# Altium schematic sheet OK6010_DB_DAC_s.SchDoc
size 260 x 195 mm; PageSetup: Record=PageOptions|CenterHorizontal=True|CenterVertical=True|PrintScale=0.82|XCorrection=1.00|YCorrection=1.00|PrintKind=2|BorderSize=5000000|LeftOffset=0|BottomOffset=0|Orientation=2|PaperLength=1000|PaperWidth=1000|Scale=100|PaperSource=15|PrintQuality=600|MediaType=1|DitherType=10|PaperKind=Letter|PrintScaleMode=1
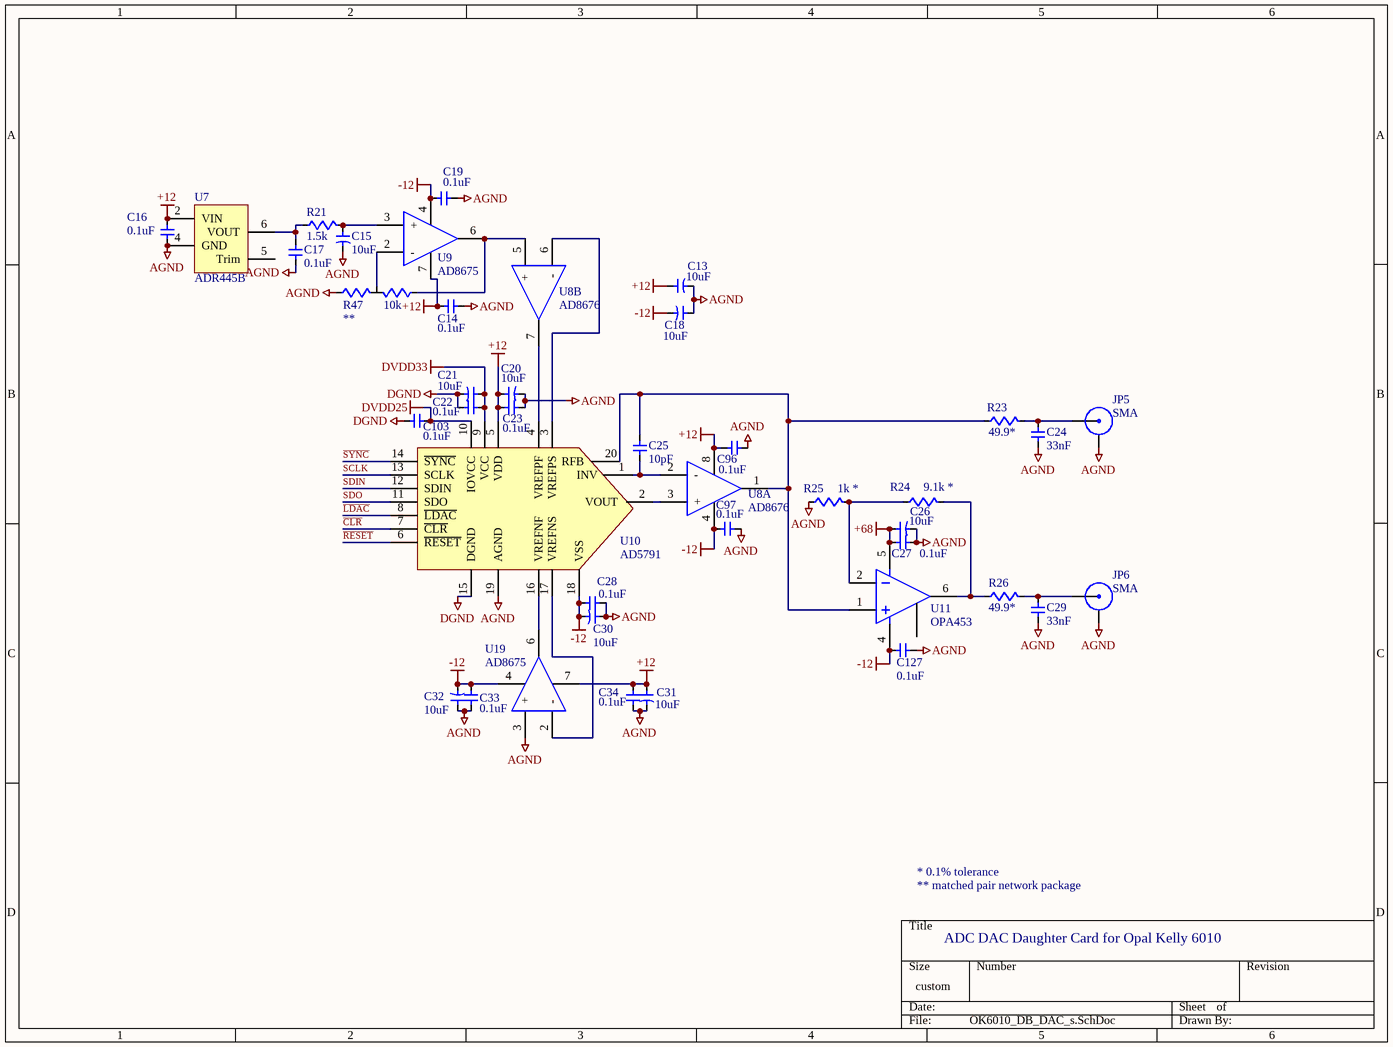
[diagram p0: OK6010_DB_DAC_s.SchDoc]

## Parts
C13  10uF  [1206]
C14  0.1uF  [0603w]
C15  10uF  [1206]
C16  0.1uF  [0603w]
C17  0.1uF  [0603w]
C18  10uF  [1206]
C19  0.1uF  [0603w]
C20  10uF  [1206]
C21  10uF  [1206]
C22  0.1uF  [0603w]
C23  0.1uF  [0603w]
C24  33nF  [0805]
C25  10pF  [0603w]
C26  10uF  [7243 V Type HD]
C27  0.1uF  [0805]
C28  0.1uF  [0603w]
C29  33nF  [0805]
C30  10uF  [1206]
C31  10uF  [1206]
C32  10uF  [1206]
C33  0.1uF  [0603w]
C34  0.1uF  [0603w]
C96  0.1uF  [0603w]
C97  0.1uF  [0603w]
C103  0.1uF  [0603w]
C127  0.1uF  [0603w]
JP5  SMA  [sma_pcb_200]
JP6  SMA  [sma_pcb_200]
R21  1.5k  [0603w]
R23  49.9*  [1206]
R24  9.1k *  [0805]
R25  1k *  [0805]
R26  49.9*  [1206]
R47  10k  [VFCD1505]
U7  ADR445B  [SOIC08]
U8  AD8676  [MSOP08]  (parts A,B of 2)
U9  AD8675  [MSOP08]
U10  AD5791  [TSSOP20]
U11  OPA453  [DDPAK-7]
U19  AD8675  [MSOP08]

## Nets
+12: C13.1 C14.1 C16.2 C20.1 C23.1 C31.1 C34.1 C96.1 U7.2(VIN) U8.8(V+) U9.7(V+) U10.5(VDD) U19.7(V+)
+68: C26.1 C27.1 U11.5
-12: C18.2 C19.1 C28.1 C30.2 C32.2 C33.1 C97.1 C127.1 U8.4(V-) U9.4(V-) U10.18(VSS) U11.4 U19.4(V-)
AGND: C13.2 C14.2 C15.2 C16.1 C17.1 C18.1 C19.2 C20.2 C23.2 C24.1 C26.2 C27.2 C28.2 C29.1 C30.1 C31.2 C32.1 C33.2 C34.2 C96.2 C97.2 C127.2 JP5.0(ground) JP6.0(ground) R25.1 R47.1 U7.4(GND) U10.19(AGND) U19.3(+)
DGND: C21.2 C22.2 C103.2 U10.15(DGND)
DVDD25: C103.1 U10.10(IOVCC)
DVDD33: C21.1 C22.1 U10.9(VCC)
~{CLR}: U10.7(~{CLR})
~{LDAC}: U10.8(~{LDAC})
~{RESET}: U10.6(~{RESET})
~{SYNC}: U10.14(~{SYNC})
SCLK: U10.13(SCLK)
SDIN: U10.12(SDIN)
SDO: U10.11(SDO)
NetC15_1: C15.1 R21.2 U9.3(+)
NetC17_2: C17.2 R21.1 U7.6(NC)
NetC24_2: C24.2 JP5.1(signal) R23.2
NetC25_1: C25.1 R23.1 U8.1(OUTA) U10.20(RFB) U11.1
NetC25_2: C25.2 U8.2(-) U10.1(INV)
NetC29_2: C29.2 JP6.1(signal) R26.2
NetR24_1: R24.1 R25.2 U11.2
NetR24_2: R24.2 R26.1 U11.6
NetR47_2: R47.2 U9.2(-)
NetR47_3: R47.3 U8.5(+) U9.6(OUT)
NetU8_3: U8.3(+) U10.2(VOUT)
NetU8_6: U8.6(-) U10.3(VREFPS)
NetU8_7: U8.7(OUTB) U10.4(VREFPF)
NetU10_16: U10.16(VREFNF) U19.6(OUT)
NetU10_17: U10.17(VREFNS) U19.2(-)

Not connected (* = marked no-connect by the designer): U7 1(NC) 5(NC); U11 7

## Notes on the sheet
- (near R47) **
- * 0.1% tolerance
- ** matched pair network package
- ADC DAC Daughter Card for Opal Kelly 6010

## Library data of the parts
C13 C15 C18 C20 C21 C30-C32 = CAPACITOR_SM: ELECTROLYTIC capacitor; Manufacturer: Nichicon; Manufacturer Part Number: F971C106MAA; Manufacturer Size Code: A; Capacitance: 10µF; ESR (Equivalent Series Resistance): 3.500 Ohm; Tolerance: ±20%; Type: Molded; Voltage - Rated: 16V; Category: Capacitors; ComponentLink1Description: http://nichicon-us.com/english/products/pdf/e-f97.pdf; ComponentLink1URL: http://nichicon-us.com/english/products/pdf/e-f97.pdf; Features: High Reliability; Height: 0.071" (1.80mm); Lead Spacing: -; Lifetime @ Temp.: -; Mounting Type: Surface Mount; Operating Temperature: -55°C ~ 125°C; Package / Case: 1206 (3216 Metric); Packaging: Cut Tape (CT); Pricing 1: 1=0.5, 10=0.398, 100=0.24, 250=0.18, 500=0.1536, 1000=0.12 (USD); RoHS: RoHS Compliant; Size / Dimension: 0.126" L x 0.063" W (3.20mm x 1.60mm); Stock 1: 885; Supplier 1: Digi-Key; Supplier Part Number 1: 493-4304-1-ND
C14 C16 C17 C19 C22 C23 C28 C33 C34 C96 C97 C103 = CAP_SM_1: capacitor; Manufacturer: Kemet; Manufacturer Part Number: C0603C104K3RACTU; Capacitance: 0.1µF; Temperature Coefficient: X7R; Tolerance: ±10%; Voltage - Rated: 25V; Applications: General Purpose; Category: Capacitors; ComponentLink1Description: http://www.kemet.com/datasheets&C0603C104K3RACTU; ComponentLink1URL: http://www.kemet.com/datasheets&C0603C104K3RACTU; Features: -; Lead Spacing: -; Lead Style: -; Mounting Type: Surface Mount, MLCC; Operating Temperature: -55°C ~ 125°C; Package / Case: 0603 (1608 Metric); Packaging: Cut Tape (CT); Pricing 1: 10=0.075, 100=0.027, 250=0.01952, 500=0.0144, 1000=0.00975 (USD); Ratings: -; RoHS: RoHS Compliant; Size / Dimension: 0.063" L x 0.032" W (1.60mm x 0.80mm); Stock 1: 2338960; Supplier 1: Digi-Key; Supplier Part Number 1: 399-1281-1-ND; Thickness: 0.80mm
C24 C29 = CAP_SM_1: capacitor; Supplier 1: Digi-Key; Supplier Part Number 1: 490-3323-1-ND
C25 = CAP_SM_1: capacitor; Manufacturer: Murata Electronics North America; Manufacturer Part Number: GRM1885C1H100JA01D; Description: CAP CER 10PF 50V 5% C0G 0603; Voltage - Rated: 50V; Tolerance: ±5%; Temperature Coefficient: C0G, NP0; Supplier 1: Digi-Key; Supplier Part Number 1: 490-1403-1-ND; RoHS: RoHS Compliant; Category: Capacitors; Stock 1: 256478; Pricing 1: 1=0.14, 10=0.085, 50=0.0408, 100=0.0306, 250=0.02212, 500=0.01632, 1000=0.01105 (USD); Capacitance: 10pF; Mounting Type: Surface Mount, MLCC; Operating Temperature: -55°C ~ 125°C; Applications: General Purpose; Ratings: -; Package / Case: 0603 (1608 Metric); Size / Dimension: 0.063" L x 0.031" W (1.60mm x 0.80mm); Height: -; Thickness: 0.035" (0.90mm); Lead Spacing: -; Features: -; Packaging: Cut Tape (CT); Lead Style: -; ComponentLink1URL: http://search.murata.co.jp/Ceramy/image/img/PDF/ENG/GRM1885C1H100JA01.pdf; ComponentLink1Description: http://search.murata.co.jp/Ceramy/image/img/PDF/ENG/GRM1885C1H100JA01.pdf
C26 = CAPACITOR_SM: ELECTROLYTIC capacitor; Manufacturer: Panasonic - ECG; Manufacturer Part Number: EEE-HD2A100P; Description: CAP 10UF 100V ELECT HD SMD; Capacitance: 10µF; Voltage Rating: 100V; Tolerance: ±20%; Lifetime @ Temp.: 5000 Hrs @ 105°C; Ripple Current: 55mA; Impedance: 1.5 Ohm; Surface Mount Land Size: 0.327" L x 0.327" W (8.30mm x 8.30mm); Supplier 1: Digi-Key; Supplier Part Number 1: PCE4986CT-ND; RoHS: RoHS Compliant; Category: Capacitors; Stock 1: 18795; Pricing 1: 1=0.98, 50=0.6264, 100=0.5638, 250=0.48548 (USD); Operating Temperature: -40°C ~ 105°C; Features: General Purpose; ESR (Equivalent Series Resistance): -; Mounting Type: Surface Mount; Package / Case: Radial, Can - SMD; Size / Dimension: 0.315" Dia (8.00mm); Height: 0.402" (10.20mm); Lead Spacing: -; Packaging: Cut Tape (CT); ComponentLink1URL: http://media.digikey.com/pdf/Data%20Sheets/Panasonic%20Capacitors%20PDFs/V%20Type%20HD%20Series.pdf; ComponentLink1Description: http://media.digikey.com/pdf/Data%20Sheets/Panasonic%20Capacitors%20PDFs/V%20Type%20HD%20Series.pdf
C27 = CAP_SM_1: capacitor; Manufacturer: Murata Electronics North America; Manufacturer Part Number: GCM21BR72A104KA37L; Description: CAP CER .1UF 100V X7R 0805; Capacitance: 0.1µF; Voltage - Rated: 100V; Tolerance: ±10%; Temperature Coefficient: X7R; Supplier 1: Digi-Key; Supplier Part Number 1: 490-4789-1-ND; RoHS: RoHS Compliant; Category: Capacitors; Stock 1: 131677; Pricing 1: 10=0.302, 50=0.1758, 100=0.1407, 250=0.10052, 500=0.06834, 1000=0.05528 (USD); Mounting Type: Surface Mount, MLCC; Operating Temperature: -55°C ~ 125°C; Applications: Automotive; Ratings: AEC-Q200; Package / Case: 0805 (2012 Metric); Size / Dimension: 0.079" L x 0.049" W (2.00mm x 1.25mm); Height: -; Thickness: 0.055" (1.40mm); Lead Spacing: -; Features: -; Packaging: Cut Tape (CT); Lead Style: -; ComponentLink1URL: http://search.murata.co.jp/Ceramy/image/img/PDF/ENG/GCM21BR72A104KA37.pdf; ComponentLink1Description: http://search.murata.co.jp/Ceramy/image/img/PDF/ENG/GCM21BR72A104KA37.pdf
C127 = CAP_SM: capacitor; Supplier 1: Digi-Key; Supplier Part Number 1: 399-1281-1-ND
JP5 JP6 = SMA_EDGE: sma connector; Manufacturer: TE Connectivity; Manufacturer Part Number: 5-1814832-1; Connector Type: Jack, Female Sockets; Contact Termination: Solder; Frequency - Max: 3GHz; Impedance: 50 Ohm; Cable Group: -; Category: Connectors, Interconnects; Color: -; ComponentLink1Description: http://documents.tycoelectronics.com/commerce/DocumentDelivery/DDEController?Action=srchrtrv&DocNm=1814832&DocType=CD&DocLang=EN; ComponentLink1URL: http://documents.tycoelectronics.com/commerce/DocumentDelivery/DDEController?Action=srchrtrv&DocNm=1814832&DocType=CD&DocLang=EN; Connector Style: SMA; Fastening Type: Threaded; Features: -; Mounting Type: Through Hole; Packaging: Bulk; Pricing 1: 1=2.7, 25=2.322, 50=2.052, 100=1.836, 250=1.62, 500=1.4364 (USD); RoHS: RoHS Compliant; Stock 1: 22563; Supplier 1: Digi-Key; Supplier Part Number 1: A97594-ND
R21 = RES_SM: resistor; Manufacturer: Yageo; Manufacturer Part Number: RC0603FR-071K5L; Description: RES 1.50K OHM 1/10W 1% 0603 SMD; Power (Watts): 0.1W, 1/10W; Temperature Coefficient: ±100ppm/°C; Tolerance: ±1%; Supplier 1: Digi-Key; Supplier Part Number 1: 311-1.50KHRCT-ND; RoHS: RoHS Compliant; Category: Resistors; Stock 1: 822850; Pricing 1: 10=0.014, 50=0.0104, 100=0.0079, 250=0.00584, 500=0.00432, 1000=0.00288 (USD); Resistance (Ohms): 1.5K; Composition: Thick Film; Features: -; Size / Dimension: 0.063" L x 0.031" W (1.60mm x 0.80mm); Height: 0.018" (0.45mm); Number of Terminations: 2; Packaging: Cut Tape (CT); Package / Case: 0603 (1608 Metric); ComponentLink1URL: http://www.yageo.com/documents/recent/PYu-RC0603_51_RoHS_L_4.pdf; ComponentLink1Description: http://www.yageo.com/documents/recent/PYu-RC0603_51_RoHS_L_4.pdf
R23 R26 = RES_SM: resistor; Manufacturer: Susumu; Manufacturer Part Number: RG3216P-49R9-B-T1; Description: RES 49.9 OHM 1/4W .1% 1206; Resistance (Ohms): 49.9; Power (Watts): 0.25W, 1/4W; Temperature Coefficient: ±25ppm/°C; Tolerance: ±0.1%; Supplier 1: Digi-Key; Supplier Part Number 1: RG32P49.9BCT-ND; RoHS: RoHS Compliant; Category: Resistors; Stock 1: 6020; Pricing 1: 10=0.612, 50=0.4354, 200=0.3402 (USD); Composition: Thin Film; Features: -; Size / Dimension: 0.126" L x 0.063" W (3.20mm x 1.60mm); Height: 0.016" (0.40mm); Number of Terminations: 2; Packaging: Cut Tape (CT); Package / Case: 1206 (3216 Metric); ComponentLink1URL: http://www.susumu.co.jp/english/pdf/e-databook7.pdf; ComponentLink1Description: http://www.susumu.co.jp/english/pdf/e-databook7.pdf
R24 = RES_SM: resistor; Manufacturer: Susumu; Manufacturer Part Number: RG2012P-912-B-T5; Description: RES 9.1K OHM 1/8W .1% 0805 SMD; Power (Watts): 0.125W, 1/8W; Temperature Coefficient: ±25ppm/°C; Tolerance: ±0.1%; Supplier 1: Digi-Key; Supplier Part Number 1: RG20P9.1KBCT-ND; RoHS: RoHS Compliant; Category: Resistors; Stock 1: 12782; Pricing 1: 10=0.409, 50=0.2478, 200=0.2047, 1000=0.10342 (USD); Resistance (Ohms): 9.1K; Composition: Thin Film; Features: -; Size / Dimension: 0.079" L x 0.049" W (2.00mm x 1.25mm); Height: 0.016" (0.40mm); Number of Terminations: 2; Packaging: Cut Tape (CT); Package / Case: 0805 (2012 Metric); ComponentLink1URL: http://www.susumu.co.jp/english/pdf/products-j01-01.pdf; ComponentLink1Description: http://www.susumu.co.jp/english/pdf/products-j01-01.pdf; Supplier 2: Digi-Key; Supplier Part Number 2: RG1608P-9091-B-T1-ND; Stock 2: 0; Pricing 2: 1000=0.08165 (USD); ComponentLink2URL: http://www.susumu-usa.com/pdf/products_8_9.pdf; ComponentLink2Description: http://www.susumu-usa.com/pdf/products_8_9.pdf
R25 = RES_SM: resistor; Supplier 1: Digi-Key; Supplier Part Number 1: RG20P1.0KBCT-ND
R47 = res_div VFCD1505: resistor network; Manufacturer: Vishay Foil Resistors (Division of Vishay Precision Group); Manufacturer Part Number: Y1685V0001TT9W; Description: RES DIV 10K/10K .01% FOIL SMD; Number of Resistors: 2; Circuit Type: Common; Temperature Coefficient: ±0.2ppm/°C; Tolerance: ±0.01%; Power Per Element: 100mW; Supplier 1: Digi-Key; Supplier Part Number 1: Y1685-10K/10K-ND; RoHS: RoHS Compliant; Category: Resistors; Stock 1: 225; Pricing 1: 1=24.42, 25=19.2752, 100=17.6688, 250=16.705, 500=16.0625 (USD); Resistance (Ohms): 10K; Number of Pins: 3; Applications: -; Package / Case: 1505 (3813 Metric); Size / Dimension: 0.150" L x 0.050" W (3.81mm x 1.27mm); Height: 0.025" (0.64mm); Mounting Type: Surface Mount; Packaging: Tube; Operating Temperature: -55°C ~ 125°C; Supplier Device Package: -; ComponentLink1URL: http://www.vishaypg.com/docs/63109/vfcd1505.pdf; ComponentLink1Description: http://www.vishaypg.com/docs/63109/vfcd1505.pdf
U7 = ADR42x: Ultra Precision Low Noise XFET Voltage Reference; Manufacturer: Analog Devices Inc; Manufacturer Part Number: ADR445BRZ; Description: IC VREF LDO XFET 5.0V 8-SOIC; Reference Type: Series, Precision; Voltage - Output: 5V; Tolerance: ±0.04%; Temperature Coefficient: 3ppm/°C; Voltage - Input: 5.5 V ~ 18 V; Number of Channels: 1; Current - Quiescent: 3.75mA; Current - Output: 10mA; Supplier 1: Digi-Key; Supplier Part Number 1: ADR445BRZ-ND; RoHS: RoHS Compliant; Category: Integrated Circuits (ICs); Stock 1: 4260; Pricing 1: 1=8.75, 25=7.1752, 100=6.475, 250=5.95, 500=5.425, 1000=4.725, 2500=4.55, 5000=4.375 (USD); Current - Cathode: -; Operating Temperature: -40°C ~ 125°C; Mounting Type: Surface Mount; Package / Case: 8-SOIC (0.154", 3.90mm Width); Supplier Device Package: 8-SOIC; Packaging: Tube; ComponentLink1URL: http://www.analog.com/static/imported-files/Data_Sheets/ADR440_441_443_444_445.pdf; ComponentLink1Description: http://www.analog.com/static/imported-files/Data_Sheets/ADR440_441_443_444_445.pdf
U8 = AD8676: ultraprecision dual rail-to-rail op amp; Manufacturer: Analog Devices Inc; Manufacturer Part Number: AD8676BRMZ-REEL; Description: IC OPAMP GP R-R 10MHZ DUAL 8MSOP; Amplifier Type: General Purpose; Number of Circuits: 2; Slew Rate: 2.5 V/µs; Gain Bandwidth Product: 10MHz; Current - Input Bias: 2nA; Voltage - Input Offset: 12µV; Current - Supply: 2.7mA; Current - Output / Channel: 20mA; Voltage - Supply, Single/Dual (±): 10 V ~ 36 V, ±5 V ~ 18 V; Supplier 1: Digi-Key; Supplier Part Number 1: AD8676BRMZ-REELCT-ND; RoHS: RoHS Compliant; Category: Integrated Circuits (ICs); Stock 1: 23534; Pricing 1: 1=6.6, 25=5.39, 100=4.84, 250=4.4, 500=3.85, 1000=3.3 (USD); Output Type: Rail-to-Rail; -3db Bandwidth: -; Operating Temperature: -40°C ~ 125°C; Mounting Type: Surface Mount; Package / Case: 8-TSSOP, 8-MSOP (0.118", 3.00mm Width); Supplier Device Package: 8-MSOP; Packaging: Cut Tape (CT); ComponentLink1URL: http://www.analog.com/static/imported-files/Data_Sheets/AD8676.pdf; ComponentLink1Description: http://www.analog.com/static/imported-files/Data_Sheets/AD8676.pdf
U9 U19 = AD8675: ultraprecision  rail-to-rail op amp; Manufacturer: Analog Devices Inc; Manufacturer Part Number: AD8675ARMZ-REEL; Description: IC OPAMP GP R-R 10MHZ PREC 8MSOP; Amplifier Type: General Purpose; Number of Circuits: 1; Slew Rate: 2.5 V/µs; Gain Bandwidth Product: 10MHz; Current - Input Bias: 500pA; Voltage - Input Offset: 10µV; Current - Supply: 2.5mA; Current - Output / Channel: 20mA; Voltage - Supply, Single/Dual (±): 10 V ~ 36 V, ±5 V ~ 18 V; Supplier 1: Digi-Key; Supplier Part Number 1: AD8675ARMZ-REELCT-ND; RoHS: RoHS Compliant; Category: Integrated Circuits (ICs); Stock 1: 6848; Pricing 1: 1=3.66, 25=2.9892, 100=2.684, 250=2.44, 500=2.135, 1000=1.83 (USD); Output Type: Rail-to-Rail; -3db Bandwidth: -; Operating Temperature: -40°C ~ 125°C; Mounting Type: Surface Mount; Package / Case: 8-TSSOP, 8-MSOP (0.118", 3.00mm Width); Supplier Device Package: 8-MSOP; Packaging: Cut Tape (CT); ComponentLink1URL: http://www.analog.com/static/imported-files/Data_Sheets/AD8675.pdf; ComponentLink1Description: http://www.analog.com/static/imported-files/Data_Sheets/AD8675.pdf
U10 = AD5791: DAC 20BIT SRL 20TSSOP; Manufacturer: Analog Devices Inc; Manufacturer Part Number: AD5791ARUZ; Description: IC DAC 20BIT UNBUFF 20-TSSOP; Settling Time: 1µs; Number of Bits: 20; Data Interface: DSP, MICROWIRE™, QSPI™, Serial, SPI™; Number of Converters: 1; Voltage Supply Source: Dual ±; Supplier 1: Digi-Key; Supplier Part Number 1: AD5791ARUZ-ND; RoHS: RoHS Compliant; Category: Integrated Circuits (ICs); Stock 1: 0; Pricing 1: 1=66.31, 25=59.2804, 100=56.266, 250=53.45272, 500=51.74462, 1000=49.63465 (USD); Power Dissipation (Max): -; Operating Temperature: -40°C ~ 125°C; Mounting Type: Surface Mount; Package / Case: 20-TSSOP (0.173", 4.40mm Width); Supplier Device Package: 20-TSSOP; Packaging: Tube; ComponentLink1URL: http://www.analog.com/static/imported-files/data_sheets/AD5791.pdf; ComponentLink1Description: http://www.analog.com/static/imported-files/data_sheets/AD5791.pdf
U11 = OPA453: 80 V op amp; Manufacturer: Texas Instruments; Manufacturer Part Number: OPA453FAKTWT; Description: IC OPAMP GP 7.5MHZ SGL TO220-7; Amplifier Type: General Purpose; Number of Circuits: 1; Slew Rate: 38 V/µs; Gain Bandwidth Product: 7.5MHz; Current - Input Bias: 7pA; Voltage - Input Offset: 1000µV; Current - Supply: 5.5mA; Current - Output / Channel: 50mA; Voltage - Supply, Single/Dual (±): 20 V ~ 80 V, ±10 V ~ 40 V; Supplier 1: Mouser; Supplier Part Number 1: 595-OPA453FAKTWT; RoHS: RoHS Compliant; Category: Integrated Circuits (ICs); Stock 1: 0; Pricing 1: 1=6.76, 25=5.61 (USD); Output Type: -; -3db Bandwidth: -; Operating Temperature: -40°C ~ 125°C; Mounting Type: Surface Mount; Package / Case: TO-263-8, D²Pak (7 Leads + Tab), TO-263CA; Supplier Device Package: 7-DDPAK; Packaging: Cut Tape (CT); ComponentLink1URL: http://focus.ti.com/lit/ds/symlink/opa452.pdf; ComponentLink1Description: http://focus.ti.com/lit/ds/symlink/opa452.pdf; Supplier 2: Mouser; Supplier 2 Part Number: 595-OPA453FAKTWT